# EAGLE design autorewers_Atmega_6 (EAGLE 7.6.0)
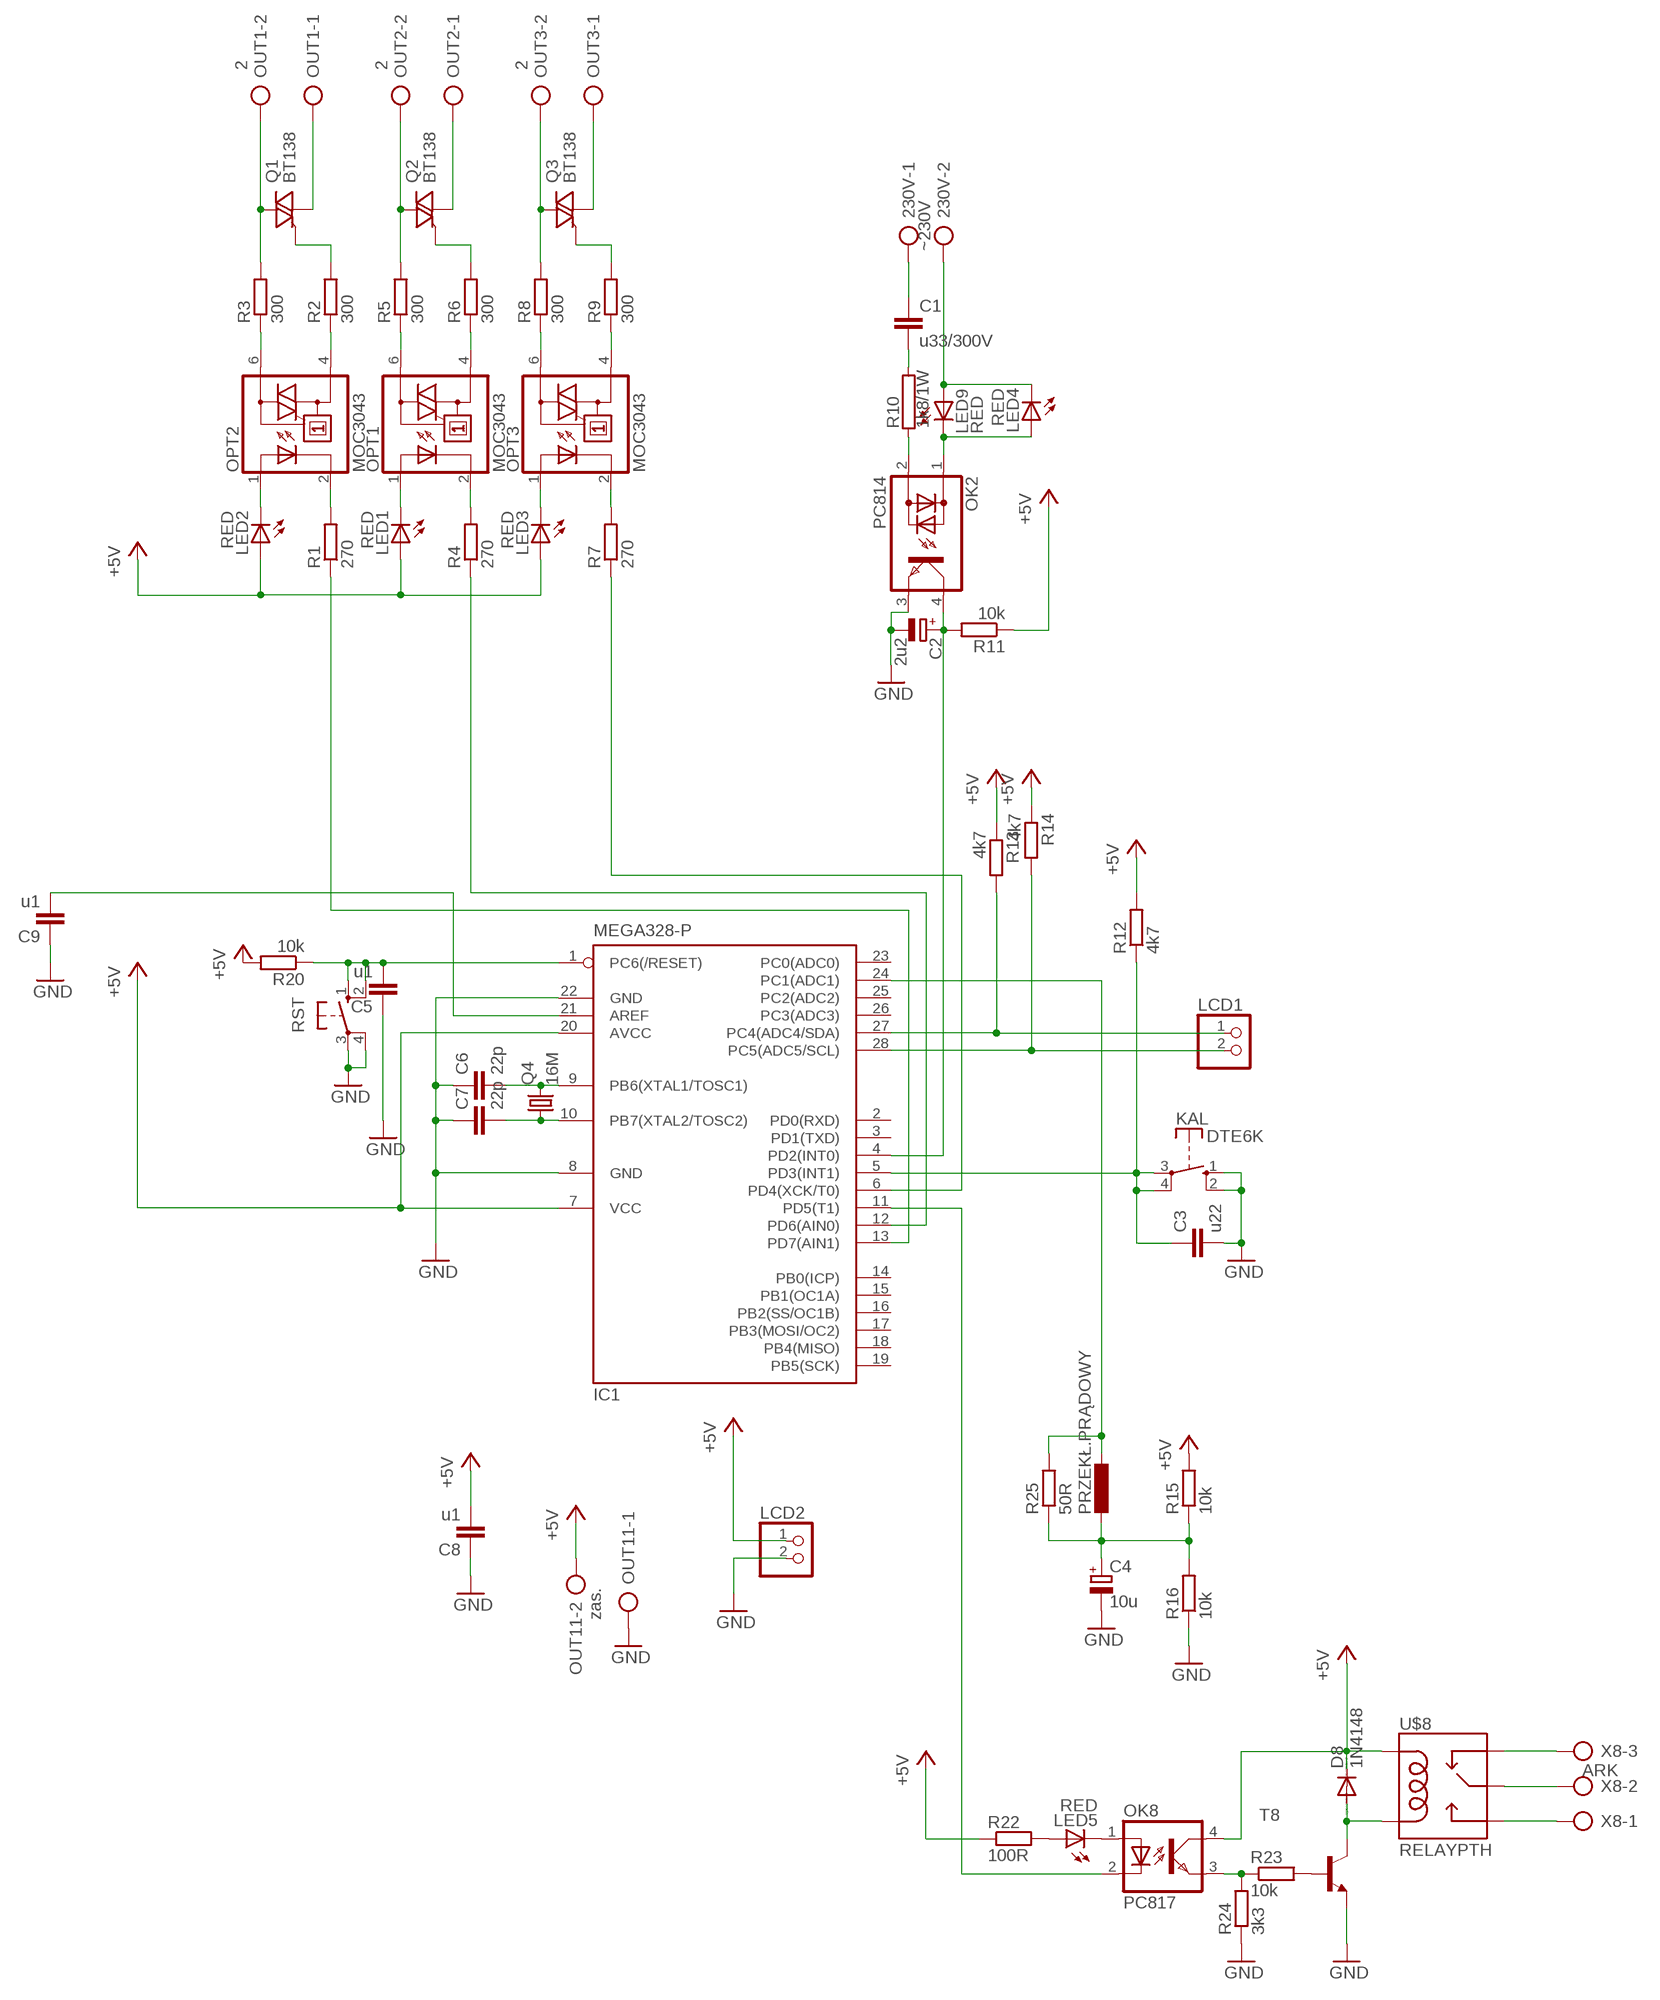
[diagram p0: schematic, sheet 1]

## Parts
230V  ~230V  AK500/2  [AK500/2]
C1  u33/300V  C-EU225-087X268  [C225-087X268]
C2  2u2  CPOL-EUB45181A  [B45181A]
C3  u22  C-EU050-025X075  [C050-025X075]
C4  10u  CPOL-EUB45181A  [B45181A]
C5  u1  C-EU050-025X075  [C050-025X075]
C6  22p  C-EU050-025X075  [C050-025X075]
C7  22p  C-EU050-025X075  [C050-025X075]
C8  u1  C-EU050-025X075  [C050-025X075]
C9  u1  C-EU050-025X075  [C050-025X075]
D8  1N4148  1N4148DO35-10  [DO35-10]
IC1  MEGA328-P  MEGA8-P  [DIL28-3]
KAL  DTE6K  [DTE6K]
LCD1  PINHD-1X2  [1X02]
LCD2  PINHD-1X2  [1X02]
LED1  RED  LED3MM  [LED3MM]
LED2  RED  LED3MM  [LED3MM]
LED3  RED  LED3MM  [LED3MM]
LED4  RED  LED3MM  [LED3MM]
LED5  RED  LED3MM  [LED3MM]
LED9  RED  LED3MM  [LED3MM]
OK2  PC814  [DIL04]
OK8  PC817  [DIL04]
OPT1  MOC3043  IL410  [DIL06]
OPT2  MOC3043  IL410  [DIL06]
OPT3  MOC3043  IL410  [DIL06]
OUT1  2  AK500/2  [AK500/2]
OUT2  2  AK500/2  [AK500/2]
OUT3  2  AK500/2  [AK500/2]
OUT11  zas.  AK500/2  [AK500/2]
PRZEKŁ.PRĄDOWY  L-EU2200-12.7  [2200-12.7]
Q1  BT138  BT138-V  [TO220BV]
Q2  BT138  BT138-V  [TO220BV]
Q3  BT138  BT138-V  [TO220BV]
Q4  16M  CRYSTALHC49S  [HC49/S]
R1  270  R-EU_0204/7  [0204/7]
R2  300  R-EU_0204/7  [0204/7]
R3  300  R-EU_0204/7  [0204/7]
R4  270  R-EU_0204/5  [0204/5]
R5  300  R-EU_0204/7  [0204/7]
R6  300  R-EU_0204/7  [0204/7]
R7  270  R-EU_0617/22  [0617/22]
R8  300  R-EU_0204/7  [0204/7]
R9  300  R-EU_0204/7  [0204/7]
R10  1k8/1W  RAC01  [AC01]
R11  10k  R-EU_0207/10  [0207/10]
R12  4k7  R-EU_0204/7  [0204/7]
R13  4k7  R-EU_0204/7  [0204/7]
R14  4k7  R-EU_0204/7  [0204/7]
R15  10k  R-EU_0204/7  [0204/7]
R16  10k  R-EU_0204/7  [0204/7]
R20  10k  R-EU_0207/15  [0207/15]
R22  100R  R-EU_0207/10  [0207/10]
R23  10k  R-EU_0204/5  [0204/5]
R24  3k3  R-EU_0204/7  [0204/7]
R25  50R  R-EU_0204/7  [0204/7]
RST  10-XX  [B3F-10XX]
T8  BC237-NPN-TO92-CBE  [TO92-CBE]
U$8  RELAYPTH  [SRD-05VDC-SL-C]
X8  ARK  AK300/3  [AK300/3]

## Nets
+5V: C8.2 D8.C IC1.7(VCC) IC1.20(AVCC) LCD2.1 LED1.A LED2.A LED3.A OK8.4(COL) OUT11.2 R11.1 R12.2 R13.1 R14.1 R15.2 R20.2 R22.1 U$8.COIL1
GND: C2.- C3.2 C4.- C5.1 C6.1 C7.1 C8.1 C9.1 IC1.8(GND) IC1.22(GND) KAL.1(S) KAL.2(S) LCD2.2 OK2.3(E) OUT11.1 R16.1 R24.1 RST.3(P) RST.4(P1) T8.E
N$1: OUT1.1 Q1.T1(A1)
N$2: C2.+ IC1.4(PD2(INT0)) OK2.4(C) R11.2
N$3: LED2.K(C) OPT2.1(A)
N$4: OPT2.2(C) R1.2
N$5: OPT1.6(A2) R5.1
N$6: Q2.G R6.2
N$7: OPT1.4(A1) R6.1
N$8: OPT2.6(A2) R3.1
N$9: OUT2.2 Q2.T2(A2) R5.2
N$10: Q1.G R2.2
N$11: OPT2.4(A1) R2.1
N$12: LED1.K(C) OPT1.1(A)
N$13: OPT1.2(C) R4.2
N$14: OPT3.6(A2) R8.1
N$15: Q3.G R9.2
N$16: OPT3.4(A1) R9.1
N$17: OUT3.2 Q3.T2(A2) R8.2
N$18: LED3.K(C) OPT3.1(A)
N$19: OPT3.2(C) R7.2
N$20: 230V.2 LED4.K(C) LED9.A
N$21: OUT3.1 Q3.T1(A1)
N$22: C1.2 R10.2
N$23: OK2.2(AC2) R10.1
N$24: LED4.A LED9.K(C) OK2.1(AC1)
N$25: C3.1 IC1.5(PD3(INT1)) KAL.3(P) KAL.4(P) R12.1
N$26: 230V.1 C1.1
N$27: IC1.12(PD6(AIN0)) R4.1
N$28: IC1.6(PD4(XCK/T0)) R7.1
N$29: IC1.24(PC1(ADC1)) PRZEKŁ.PRĄDOWY.1 R25.2
N$30: IC1.13(PD7(AIN1)) R1.1
N$31: C6.2 IC1.9(PB6(XTAL1/TOSC1)) Q4.2
N$32: C4.+ PRZEKŁ.PRĄDOWY.2 R15.1 R16.2 R25.1
N$33: U$8.SWOPEN X8.1
N$34: U$8.SWCLOSED(SWCLOSE) X8.3
N$35: LED5.K(C) OK8.1(A)
N$36: C5.2 IC1.1(PC6(/RESET)) R20.1 RST.1(S) RST.2(S1)
N$37: IC1.11(PD5(T1)) OK8.2(C)
N$38: LED5.A R22.2
N$39: IC1.27(PC4(ADC4/SDA)) LCD1.1 R13.2
N$40: C7.2 IC1.10(PB7(XTAL2/TOSC2)) Q4.1
N$41: IC1.28(PC5(ADC5/SCL)) LCD1.2 R14.2
N$42: OUT2.1 Q2.T1(A1)
N$59: OK8.3(EMIT) R23.1 R24.2
N$60: R23.2 T8.B
N$61: D8.A T8.C U$8.COIL0
N$63: U$8.SWCOMMON X8.2
N$106: OUT1.2 Q1.T2(A2) R3.2
S$1: C9.2 IC1.21(AREF)
Unconnected: IC1.2(PD0(RXD)) IC1.3(PD1(TXD)) IC1.14(PB0(ICP)) IC1.15(PB1(OC1A)) IC1.16(PB2(SS/OC1B)) IC1.17(PB3(MOSI/OC2)) IC1.18(PB4(MISO)) IC1.19(PB5(SCK)) IC1.23(PC0(ADC0)) IC1.25(PC2(ADC2)) IC1.26(PC3(ADC3))

## Library data of the parts
230V OUT1-OUT3 OUT11 = con-ptr500:AK500/2: CONNECTOR; OC_FARNELL: unknown; OC_NEWARK: unknown
C1 C3 C5-C9 = resistor:C-EU: CAPACITOR, European symbol
C2 C4 = resistor:CPOL-EU: POLARIZED CAPACITOR, European symbol
D8 = diode:1N4148: DIODE high speed (Philips)
IC1 = atmel:MEGA8-P: MICROCONTROLLER 8 Kbytes FLASH, 1 kbytes SRAM, 512 bytes EEPROM, USART, 4-channel 10 bit ADC, 2-channel 8 bit ADC Pin compatible with Atmega48, ATMega88, ATMega168 Source: avr.lbr; OC_FARNELL: unknown; OC_NEWARK: unknown
KAL = switch-misc:DT: ITT SWITCH
LCD1 LCD2 = pinhead:PINHD-1X2: PIN HEADER
LED1-LED5 LED9 = led:LED: LED OSRAM: - CHIPLED LG R971, LG N971, LY N971, LG Q971, LY Q971, LO R971, LY R971 LH N974, LH R974 LS Q976, LO Q976, LY Q976 LO Q996 - Hyper CHIPLED LW Q18S LB Q993, LB Q99A, LB R99A - SideLED LS A670, LO A670, LY A670, LG A670, LP A670 LB A673, LV A673, LT A673, LW A673 LH A674 LY A675 LS A676, LA A676, LO A676, LY A676, LW A676 LS A679, LY A679, LG A679 - Hyper Micro SIDELED® LS Y876, LA Y876, LO Y876, LY Y876 LT Y87S - SmartLED LW L88C, LW L88S LB L89C, LB L89S, LG L890 LS L89K, LO L89K, LY L89K LS L896, LA L896, LO L896, LY L896 - TOPLED LS T670, LO T670, LY T670, LG T670, LP T670 LSG T670, LSP T670, LSY T670, LOP T670, LYG T670 LG T671, LOG T671, LSG T671 LB T673, LV T673, LT T673, LW T673 LH T674 LS T676, LA T676, LO T676, LY T676, LB T676, LH T676, LSB T676, LW T676 LB T67C, LV T67C, LT T67C, LS T67K, LO T67K, LY T67K, LW E67C LS E67B, LA E67B, LO E67B, LY E67B, LB E67C, LV E67C, LT E67C LW T67C LS T679, LY T679, LG T679 LS T770, LO T770, LY T770, LG T770, LP T770 LB T773, LV T773, LT T773, LW T773 LH T774 LS E675, LA E675, LY E675, LS T675 LS T776, LA T776, LO T776, LY T776, LB T776 LHGB T686 LT T68C, LB T68C - Hyper Mini TOPLED® LB M676 - Mini TOPLED Santana® LG M470 LS M47K, LO M47K, LY M47K Source: http://www.osram.convergy.de LUXEON: - LUMILED® LXK2-PW12-R00, LXK2-PW12-S00, LXK2-PW14-U00, LXK2-PW14-V00 LXK2-PM12-R00, LXK2-PM12-S00, LXK2-PM14-U00 LXK2-PE12-Q00, LXK2-PE12-R00, LXK2-PE12-S00, LXK2-PE14-T00, LXK2-PE14-U00 LXK2-PB12-K00, LXK2-PB12-L00, LXK2-PB12-M00, LXK2-PB14-N00, LXK2-PB14-P00, LXK2-PB14-Q00 LXK2-PR12-L00, LXK2-PR12-M00, LXK2-PR14-Q00, LXK2-PR14-R00 LXK2-PD12-Q00, LXK2-PD12-R00, LXK2-PD12-S00 LXK2-PH12-R00, LXK2-PH12-S00 LXK2-PL12-P00, LXK2-PL12-Q00, LXK2-PL12-R00 Source: www.luxeon.com KINGBRIGHT: KA-3528ASYC Source: www.kingbright.com
OK2 = optocoupler:PC814: SHARP OPTO COUPLER; OC_FARNELL: 9707662; OC_NEWARK: unknown
OK8 = optocoupler:PC817: SHARP OPTO COUPLER; MPN: PC817X4J000F; OC_FARNELL: 9707727; OC_NEWARK: 97K7059
OPT1-OPT3 = optocoupler:IL410: SIEMENS OPTO COUPLER; MF: FAIRCHILD SEMICONDUCTOR; MPN: MOC3041; OC_FARNELL: 1045434; OC_NEWARK: 58K1715
PRZEKŁ.PRĄDOWY = resistor:L-EU: INDUCTOR, European symbol
Q1-Q3 = triac:BT138: TRIAC Source: http://www.semiconductors.philips.com BT138_SERIES_2.pdf
Q4 = crystal:CRYSTAL: CRYSTAL; OC_FARNELL: 1667008; OC_NEWARK: unknown
R1-R9 R11-R16 R20 R25 = rcl:R-EU_: RESISTOR, European symbol
R10 = resistor-power:R: Power Resitor; OC_FARNELL: unknown; OC_NEWARK: unknown
R22-R24 = resistor:R-EU_: RESISTOR, European symbol
RST = switch-omron:10-XX: OMRON SWITCH; MPN: B3F-1000; OC_FARNELL: 176432; OC_NEWARK: 36M3542
T8 = transistor:*-NPN-: NPN Transistror BF959 corrected 2008.03.06
U$8 = SRD-05VDC-SL-C:RELAY: SPDT relay (COM-00101)
X8 = con-ptr500 (2):AK300/3: CONNECTOR

## Net classes
0 default: clearance 0.4 mm

## Board
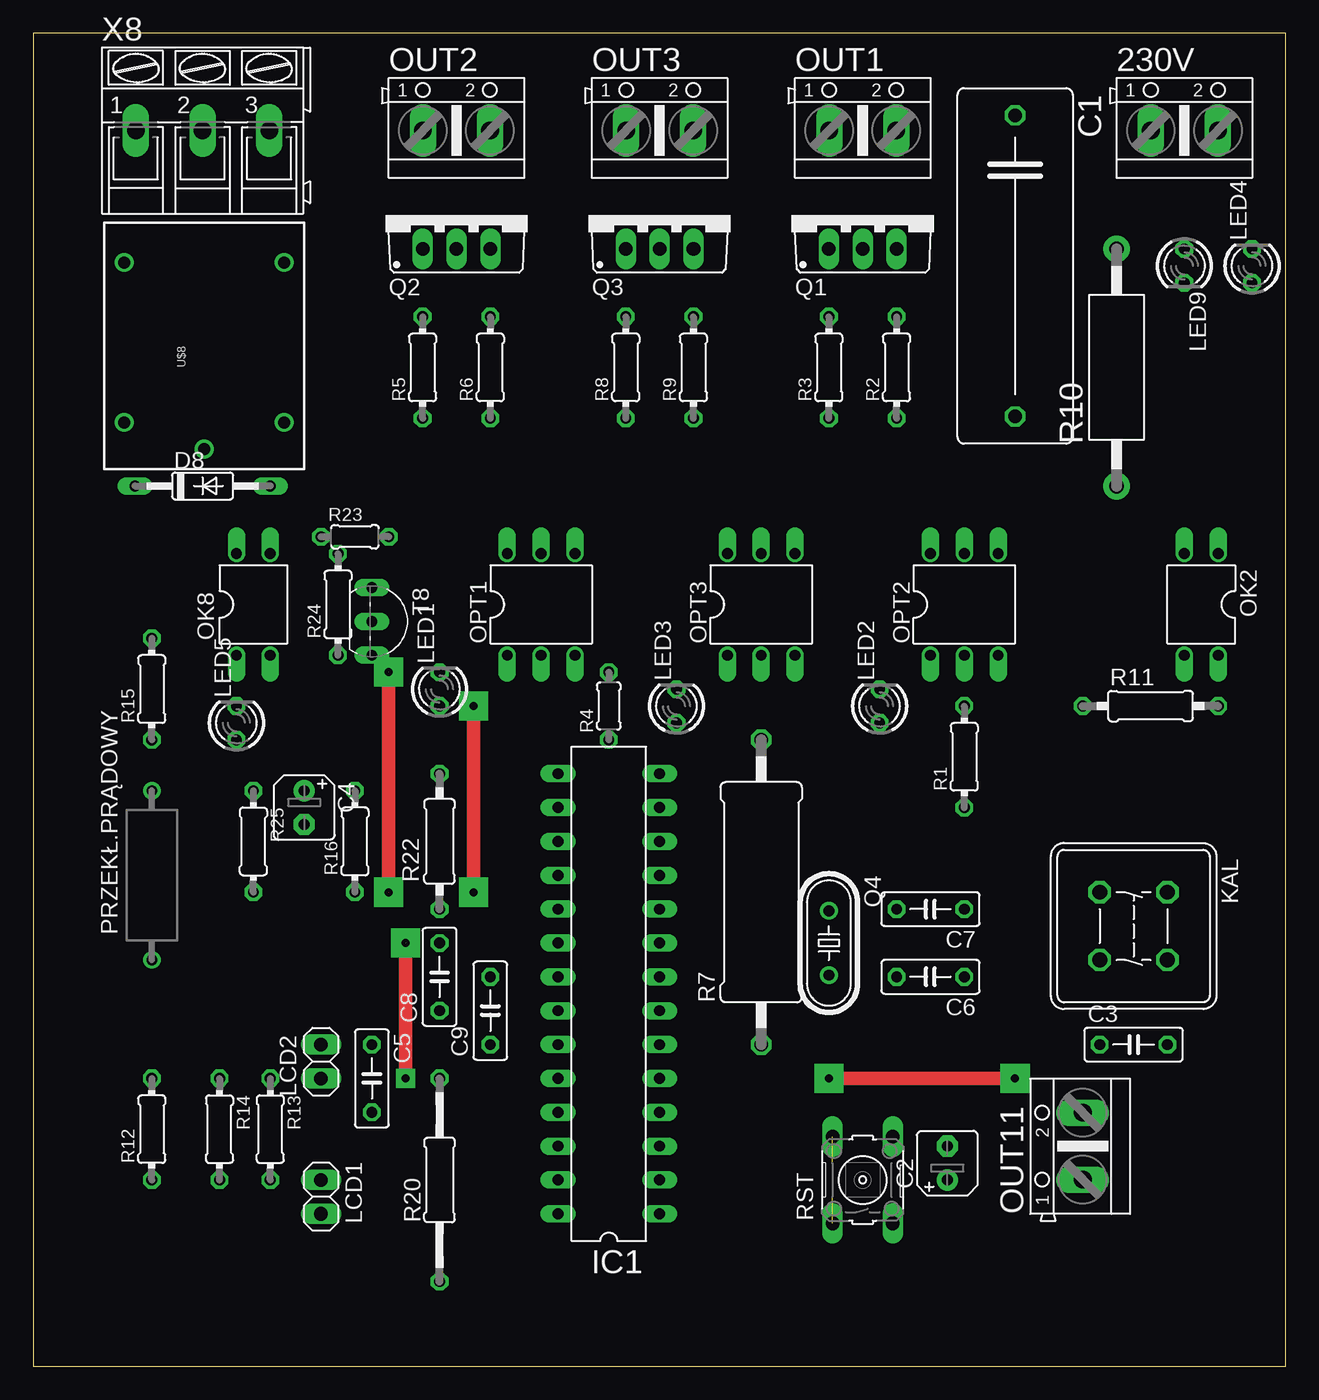
[diagram p1: board, top side]
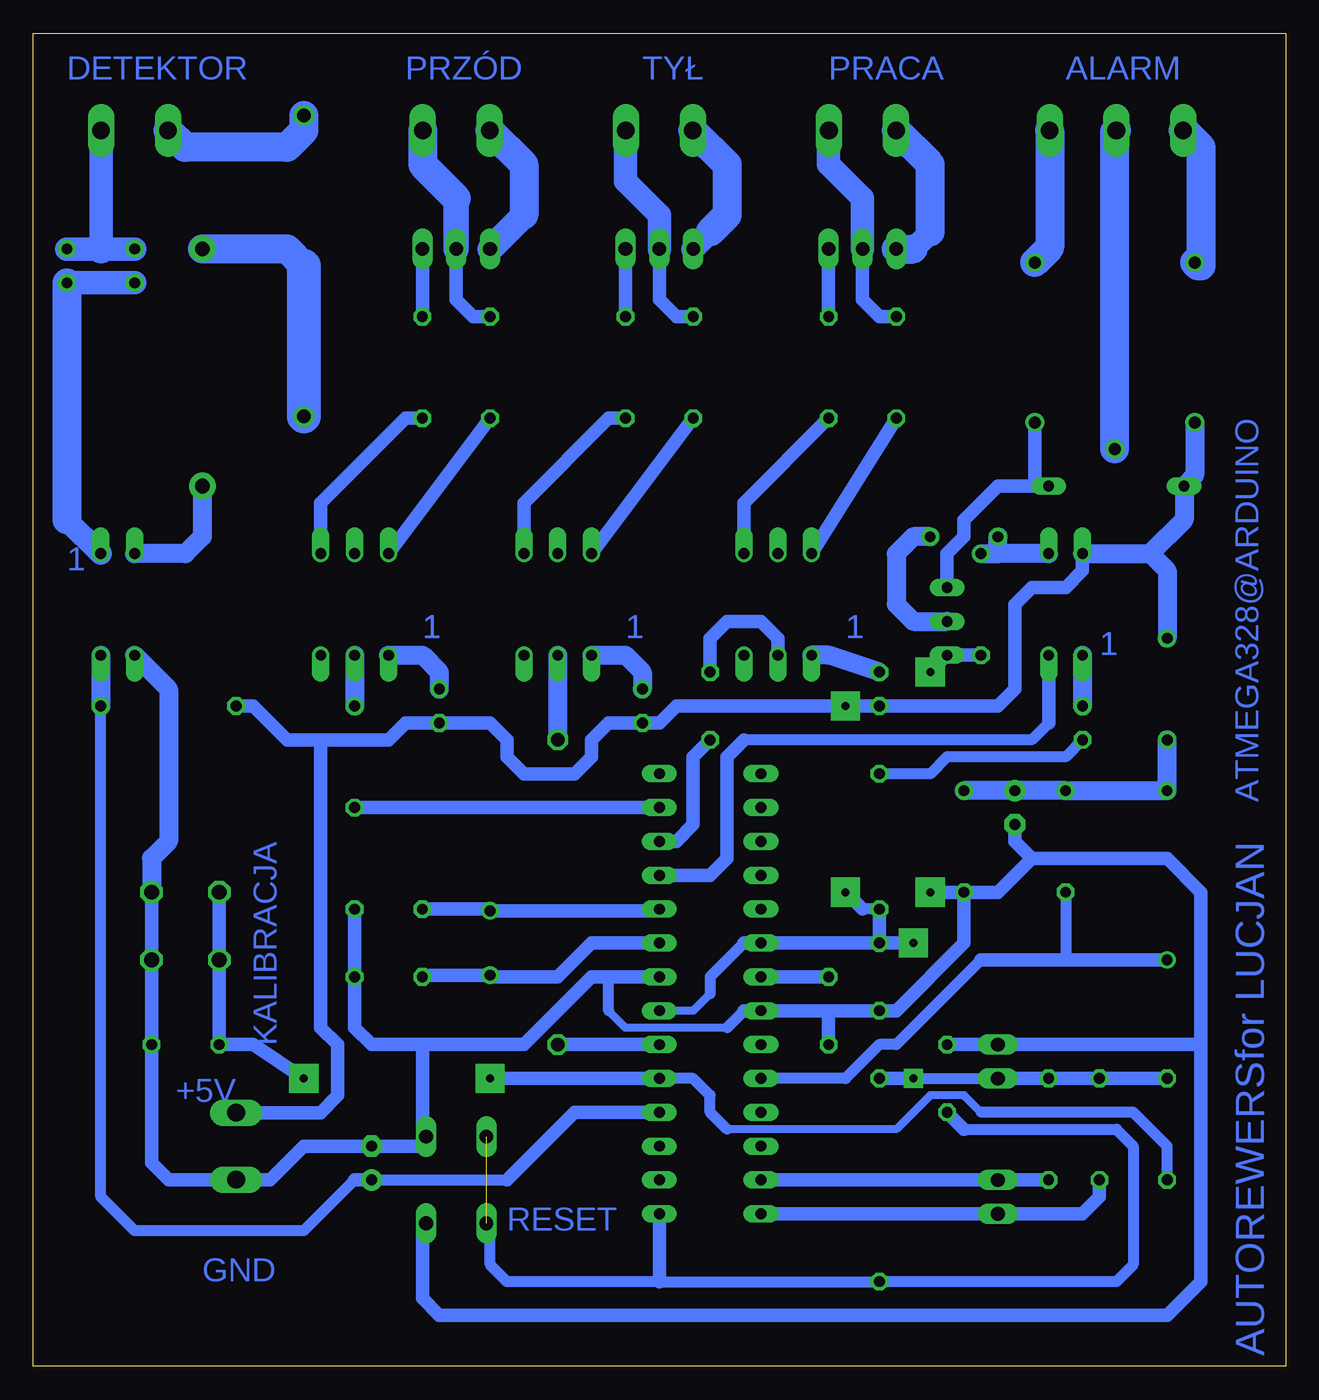
[diagram p2: board, bottom side, seen from below]

Size 93.96 x 100 mm. Coordinates in mm from the lower left corner, seen from the top.
Outline: 0,0 93.96,0 93.96,100 0,100 0,0
Copper layers (1*16): Top 0.035mm / dielectric 1.5mm / Bottom 0.035mm
Design rules "autorewers_Atmega_6": minimum track width 10mil, minimum drill 24mil, track to track 0.205mm, track to pad 0.205mm, pad to pad 0.205mm, via to via 0.205mm, smd to smd 8mil, copper to edge 40mil, drill to drill 8mil, minimum pad ring 10mil, minimum via ring 8mil, stop-mask expansion 4mil, vias tented up to drill 0mil, thermal gap 10mil

### Footprints (pad centres in the part's own frame; a part is rotated, then mirrored left to right if it is on the bottom)
AK500/2 = drill 1.321 long: 1 -2.515,0; 2 2.515,0
C225-087X268 = drill 1.016 octagon: 1 -11.303,0; 2 11.303,0
B45181A = drill 0.813 pad 1.6: + -1.27,0 | drill 0.813 pad 1.6 octagon: - 1.27,0
C050-025X075 = drill 0.813 octagon: 1 -2.54,0; 2 2.54,0
DO35-10 = drill 0.813 long: A 5.08,0; C -5.08,0
DIL28-3 = drill 0.813 long: 1 -16.51,-3.81; 2 -13.97,-3.81; 3 -11.43,-3.81; 4 -8.89,-3.81; 5 -6.35,-3.81; 6 -3.81,-3.81; 7 -1.27,-3.81; 8 1.27,-3.81; 9 3.81,-3.81; 10 6.35,-3.81; 11 8.89,-3.81; 12 11.43,-3.81; 13 13.97,-3.81; 14 16.51,-3.81; 15 16.51,3.81; 16 13.97,3.81; 17 11.43,3.81; 18 8.89,3.81; 19 6.35,3.81; 20 3.81,3.81; 21 1.27,3.81; 22 -1.27,3.81; 23 -3.81,3.81; 24 -6.35,3.81; 25 -8.89,3.81; 26 -11.43,3.81; 27 -13.97,3.81; 28 -16.51,3.81
DTE6K = drill 1.118 octagon: 1 -2.54,2.54; 2 2.54,2.54; 3 2.54,-2.54; 4 -2.54,-2.54
1X02 = drill 1.016 long: 1 -1.27,0; 2 1.27,0
LED3MM = drill 0.813 octagon: A -1.27,0; K 1.27,0
DIL04 = drill 0.813 offset: 1 -1.27,-3.81; 2 1.27,-3.81; 3 1.27,3.81; 4 -1.27,3.81
DIL06 = drill 0.813 offset: 1 -2.54,-3.81; 2 0,-3.81; 3 2.54,-3.81; 4 2.54,3.81; 5 0,3.81; 6 -2.54,3.81
2200-12.7 = drill 0.8 pad 1.27: 1 -6.35,0; 2 6.35,0
TO220BV = drill 1.016 long: G 2.54,-2.54; T1 -2.54,-2.54; T2 0,-2.54
HC49/S = drill 0.813: 1 -2.413,0; 2 2.413,0
0204/7 = drill 0.813 octagon: 1 -3.81,0; 2 3.81,0
0204/5 = drill 0.813 octagon: 1 -2.54,0; 2 2.54,0
0617/22 = drill 1.016 octagon: 1 -11.43,0; 2 11.43,0
AC01 = drill 1.1 pad 2: 1 -8.9,0; 2 8.9,0
0207/10 = drill 0.813 octagon: 1 -5.08,0; 2 5.08,0
0207/15 = drill 0.813 octagon: 1 -7.62,0; 2 7.62,0
B3F-10XX = drill 1.016 long: 1 -3.251,2.261; 2 3.251,2.261; 3 -3.251,-2.261; 4 3.251,-2.261
TO92-CBE = drill 0.813 long: B 0,0; C -2.54,0; E 2.54,0
SRD-05VDC-SL-C = drill 0.9: COIL0 -5.39,-6.12; COIL1 -5.39,5.88; SWCLOSED 6.61,-6.12; SWCOMMON -7.39,-0.12; SWOPEN 6.61,5.88
AK300/3 = drill 1.321 long: 1 -5.004,0; 2 0,0; 3 5.004,0

### Placement (x,y rotation side)
230V  86.36,92.71 0 top
C1  73.66,82.55 270 top
C2  68.58,15.24 90 top
C3  82.55,24.13 0 top
C4  20.32,41.91 270 top
C5  25.4,21.59 270 top
C6  67.31,29.21 180 top
C7  67.31,34.29 180 top
C8  30.48,29.21 90 top
C9  34.29,26.67 90 top
D8  12.7,66.04 0 top
IC1  43.18,27.94 90 top
KAL  82.55,33.02 270 top
LCD1  21.59,12.7 270 top
LCD2  21.59,22.86 90 top
LED1  30.48,50.8 90 top
LED2  63.5,49.53 90 top
LED3  48.26,49.53 90 top
LED4  91.44,82.55 90 top
LED5  15.24,48.26 90 top
LED9  86.36,82.55 270 top
OK2  87.63,57.15 180 top
OK8  16.51,57.15 0 top
OPT1  38.1,57.15 0 top
OPT2  69.85,57.15 0 top
OPT3  54.61,57.15 0 top
OUT1  62.23,92.71 0 top
OUT2  31.75,92.71 0 top
OUT3  46.99,92.71 0 top
OUT11  78.74,16.51 90 top
PRZEKŁ.PRĄDOWY  8.89,36.83 90 top
Q1  62.23,86.36 0 top
Q2  31.75,86.36 0 top
Q3  46.99,86.36 0 top
Q4  59.69,31.75 270 top
R1  69.85,45.72 90 top
R2  64.77,74.93 90 top
R3  59.69,74.93 90 top
R4  43.18,49.53 90 top
R5  29.21,74.93 90 top
R6  34.29,74.93 90 top
R7  54.61,35.56 90 top
R8  44.45,74.93 90 top
R9  49.53,74.93 90 top
R10  81.28,74.93 90 top
R11  83.82,49.53 0 top
R12  8.89,17.78 90 top
R13  17.78,17.78 270 top
R14  13.97,17.78 270 top
R15  8.89,50.8 90 top
R16  24.13,39.37 90 top
R20  30.48,13.97 90 top
R22  30.48,39.37 90 top
R23  24.13,62.23 0 top
R24  22.86,57.15 90 top
R25  16.51,39.37 270 top
RST  62.23,13.97 90 top
T8  25.4,55.88 270 top
U$8  12.7,76.2 90 top
X8  12.7,92.71 0 top

### Tracks (layer width: path | path; a pad name or v marks a point on that pad's centre or on a via)
+5V  (via drill 0.6 pad 1.42, 0.6 pad 2.18)  (1 unrouted)
  Top 1.016: v33.02,35.56 v33.02,49.53 | 27.94,31.75 v27.94,21.59
  Bottom 0.61: 43.18,27.94 44.45,26.67 IC1.7
  Bottom 0.813: v27.94,21.59 LCD2.1 | 40.64,31.75 43.18,29.21 43.18,27.94 | R22.1 31.75,34.29
  Bottom 1.016: 72.39,46.99 67.31,46.99 66.04,48.26 LED2.A 59.69,48.26 58.42,46.99 58.42,45.72 57.15,44.45 53.34,44.45 52.07,45.72 52.07,46.99 50.8,48.26 LED3.A 46.99,48.26 45.72,49.53 v33.02,49.53 LED1.A 21.59,49.53 20.32,50.8 20.32,57.15 19.05,58.42 16.51,58.42 15.24,59.69 OK8.4 | 72.39,46.99 74.93,46.99 77.47,49.53 R11.1 | R20.2 v27.94,21.59 | LCD2.1 R13.1 R14.1 R12.2 | R22.1 C8.2 | C8.2 IC1.20 40.64,31.75 | 31.75,34.29 v33.02,35.56 | C8.2 27.94,31.75 | OUT11.2 72.41,19.02 71.12,20.32 71.12,24.13 72.39,25.4 72.39,46.99
  Bottom 1.422: U$8.COIL1 6.82,66.84 D8.C 7.62,63.5 10.16,60.96 | OK8.4 10.16,60.96 | 10.16,60.96 8.89,59.69 R15.2
GND  (2 unrouted)
  Top 1.016: 26.67,35.56 26.67,52.07
  Bottom 0.61: 41.91,25.4 49.53,25.4 50.8,26.67
  Bottom 0.813: 40.64,26.67 41.91,25.4 | 50.8,26.67 50.8,29.21
  Bottom 1.016: R24.1 T8.E 26.67,52.07 | IC1.8 50.8,29.21 52.07,29.21 57.15,24.13 64.77,24.13 | 64.77,24.13 68.58,24.13 69.85,25.4 C6.1 C7.1 | 64.77,24.13 64.77,17.5 RST.4 64.49,16.79 64.77,16.51 | 64.77,16.51 C2.- 73.66,16.51 76.2,13.97 78.72,13.97 OUT11.1 78.76,13.97 83.82,13.97 85.09,15.24 C3.2 KAL.2 KAL.1 | 64.77,16.51 64.49,16.51 | 6.35,24.13 6.35,6.35 8.89,3.81 63.5,3.81 64.77,5.08 64.77,10.44 RST.3 | 40.64,26.67 IC1.22 34.29,26.67 | LCD2.2 C5.1 6.35,24.13 | R16.1 24.13,31.75 29.21,26.67 C8.1 34.29,26.67 | R16.1 26.67,35.56 | R16.1 21.59,35.56 19.05,38.1 | 19.05,38.1 8.89,38.1 6.35,35.56 6.35,24.13 | C4.- 20.32,39.37 19.05,38.1 | C9.1 34.29,26.67
  Bottom 1.422: OK2.3 83.82,50.8 83.82,39.37 85.09,38.1 KAL.1
N$1
  Bottom 1.93: 57.15,86.36 Q1.T1
  Bottom 2.184: OUT1.1 59.69,92.71 57.15,90.17 57.15,86.36
N$2
  Bottom 0.813: C2.+ 58.42,13.97 | 69.85,13.97 73.66,10.16 86.36,10.16 88.9,12.7 R11.2
  Bottom 1.016: 58.42,13.97 53.34,19.05 IC1.4 | C2.+ 69.85,13.97
  Bottom 1.422: OK2.4 R11.2
N$3
  Bottom 1.422: OPT2.1 64.77,53.34 63.5,52.07 LED2.K
N$4
  Bottom 1.422: OPT2.2 R1.2
N$5
  Bottom 1.016: R5.1 OPT1.6
N$6
  Bottom 1.016: Q2.G R6.2
N$7
  Bottom 1.016: OPT1.4 40.64,64.77 R6.1
N$8
  Bottom 1.016: R3.1 OPT2.6
N$9
  Bottom 1.016: Q2.T2 31.75,80.01 30.48,78.74 R5.2
  Bottom 1.778: Q2.T2 31.75,87.63 34.29,90.17 34.29,92.69 OUT2.2
N$10
  Bottom 1.016: R2.2 Q1.G
N$11
  Bottom 1.016: OPT2.4 72.39,64.77 66.04,71.12 R2.1
N$12
  Bottom 1.422: LED1.K 34.29,53.34 OPT1.1
N$13
  Bottom 1.016: OPT1.2 38.1,54.61 39.37,55.88 41.91,55.88 43.18,54.61 R4.2
N$14
  Bottom 1.016: OPT3.6 R8.1
N$15
  Bottom 1.016: Q3.G R9.2
N$16
  Bottom 1.016: OPT3.4 57.15,64.77 50.8,71.12 R9.1
N$17
  Bottom 1.016: R8.2 45.72,78.74 46.99,80.01 Q3.T2
  Bottom 1.778: Q3.T2 46.99,86.36 49.53,88.9 49.53,92.69 OUT3.2
N$18
  Bottom 1.422: OPT3.1 49.53,53.34 48.26,52.07 LED3.K
N$19
  Bottom 1.422: OPT3.2 R7.2
N$20
  Bottom 1.778: 230V.2 88.88,83.84 | LED9.A 88.9,83.82 LED4.K
  Bottom 2.184: 88.88,83.84 88.9,83.82
N$21
  Bottom 1.778: Q3.T1 43.18,85.09
  Bottom 2.184: OUT3.1 44.45,92.71 41.91,90.17 41.91,86.36 43.18,85.09
N$22
  Bottom 2.184: R10.2 74.94,83.83 73.66,82.55
  Bottom 2.54: 73.66,82.55 C1.2
N$23
  Bottom 1.422: R10.1 81.28,62.23 82.55,60.96 OK2.2
N$24
  Bottom 1.676: 91.44,63.5 OK2.1
  Bottom 1.778: LED9.K LED4.A
  Bottom 2.184: LED4.A 91.44,63.5
N$25  (via drill 0.6 pad 2.18)
  Top 1.016: v73.66,21.59 v59.69,21.59
  Bottom 0.61: 22.86,19.05 24.13,20.32 26.67,20.32 29.21,17.78 41.91,17.78
  Bottom 0.813: R12.1 8.89,16.51 11.43,19.05 22.86,19.05 | 41.91,17.78 43.18,19.05 43.18,20.32 44.45,21.59 IC1.5
  Bottom 1.016: KAL.4 KAL.3 C3.1 77.47,24.13 v73.66,21.59 | IC1.5 v59.69,21.59
N$26
  Bottom 2.184: C1.1 73.66,92.71 74.93,91.44 82.57,91.44 230V.1
N$27
  Bottom 1.016: R4.1 44.45,45.72 44.45,40.64 45.72,39.37 IC1.12
N$28
  Bottom 1.016: IC1.6 R7.1
N$29
  Bottom 0.813: R25.2 16.51,30.48 | 22.86,30.48 29.21,24.13 30.48,24.13 33.02,21.59 IC1.24
  Bottom 1.016: PRZEKŁ.PRĄDOWY.1 16.51,30.48 22.86,30.48
N$30
  Bottom 1.016: IC1.13 R1.1
N$31
  Bottom 1.016: IC1.9 52.07,31.75 54.61,29.21 59.56,29.21 Q4.2 64.64,29.34 C6.2
N$32
  Bottom 1.422: R15.1 PRZEKŁ.PRĄDOWY.2 R25.1 C4.+ R16.2
N$33
  Bottom 2.184: X8.1 7.62,92.71 6.35,91.44 6.35,82.55 6.56,82.55 U$8.SWOPEN
N$34
  Bottom 2.184: X8.3 17.7,83.93 U$8.SWCLOSED
N$35
  Bottom 1.422: OK8.1 LED5.K
N$36  (1 unrouted)
  Bottom 0.813: 24.13,17.78 12.7,17.78 11.43,16.51 11.43,7.62 12.7,6.35 R20.1 46.99,6.35 58.42,6.35 59.69,7.62 59.69,10.44 RST.1
  Bottom 1.016: C5.2 24.13,17.78 | IC1.1 46.99,6.35
N$37
  Bottom 0.813: 17.78,48.26 19.05,46.99 40.64,46.99
  Bottom 1.016: OK8.2 17.78,48.26 | 40.64,46.99 41.91,45.72 41.91,38.1 43.18,36.83 IC1.11
N$38
  Bottom 0.813: LED5.A 16.51,45.72 25.4,45.72 26.67,44.45 R22.2
N$39
  Bottom 1.016: R13.2 LCD1.1 IC1.27
N$40
  Bottom 1.016: C7.2 59.82,34.29 Q4.1 47.12,34.16 IC1.10
N$41
  Bottom 1.016: IC1.28 LCD1.2 15.24,11.43 13.97,12.7 R14.2
N$42
  Bottom 1.778: 27.94,83.82 26.67,85.09
  Bottom 2.184: Q2.T1 27.94,83.82 | 26.67,85.09 26.67,90.17 29.21,92.71 OUT2.1
N$59
  Bottom 1.422: R24.2 21.59,60.96 | 21.59,60.96 R23.1 | OK8.3 21.59,60.96
N$60
  Bottom 1.422: R23.2 27.94,62.23 29.21,60.96 29.21,57.15 27.94,55.88 T8.B
N$61
  Bottom 1.016: D8.A 19.05,66.04 | 19.05,66.04 21.59,66.04 24.13,63.5 24.13,62.23 25.4,60.96 T8.C | U$8.COIL0 18.82,66.27 19.05,66.04
N$62  (via drill 0.6 pad 2.18)
  other vias: 26.67,52.07
N$63
  Bottom 2.184: U$8.SWCOMMON 12.82,92.59 X8.2
N$64  (via drill 0.6 pad 2.18)
  other vias: 26.67,35.56
N$65  (via drill 0.6 pad 2.18)
  other vias: 27.94,31.75
N$106
  Bottom 1.016: R3.2 60.96,78.74 62.23,80.01 Q1.T2
  Bottom 1.93: 62.23,87.63 Q1.T2
  Bottom 2.184: OUT1.2 64.75,90.14 62.23,87.63
S$1
  Bottom 1.016: IC1.21 C9.2

### Text on the board
Bottom: ALARM | PRACA | TYŁ | PRZÓD | DETEKTOR | ATMEGA328@ARDUINO | 1 | 1 | 1 | 1 | 1 | 1 | for LUCJAN | KALIBRACJA | AUTOREWERS | +5V | RESET | GND